# Altium project 36V E-Bike Reference Design.PrjPCB (part 1 of 4)
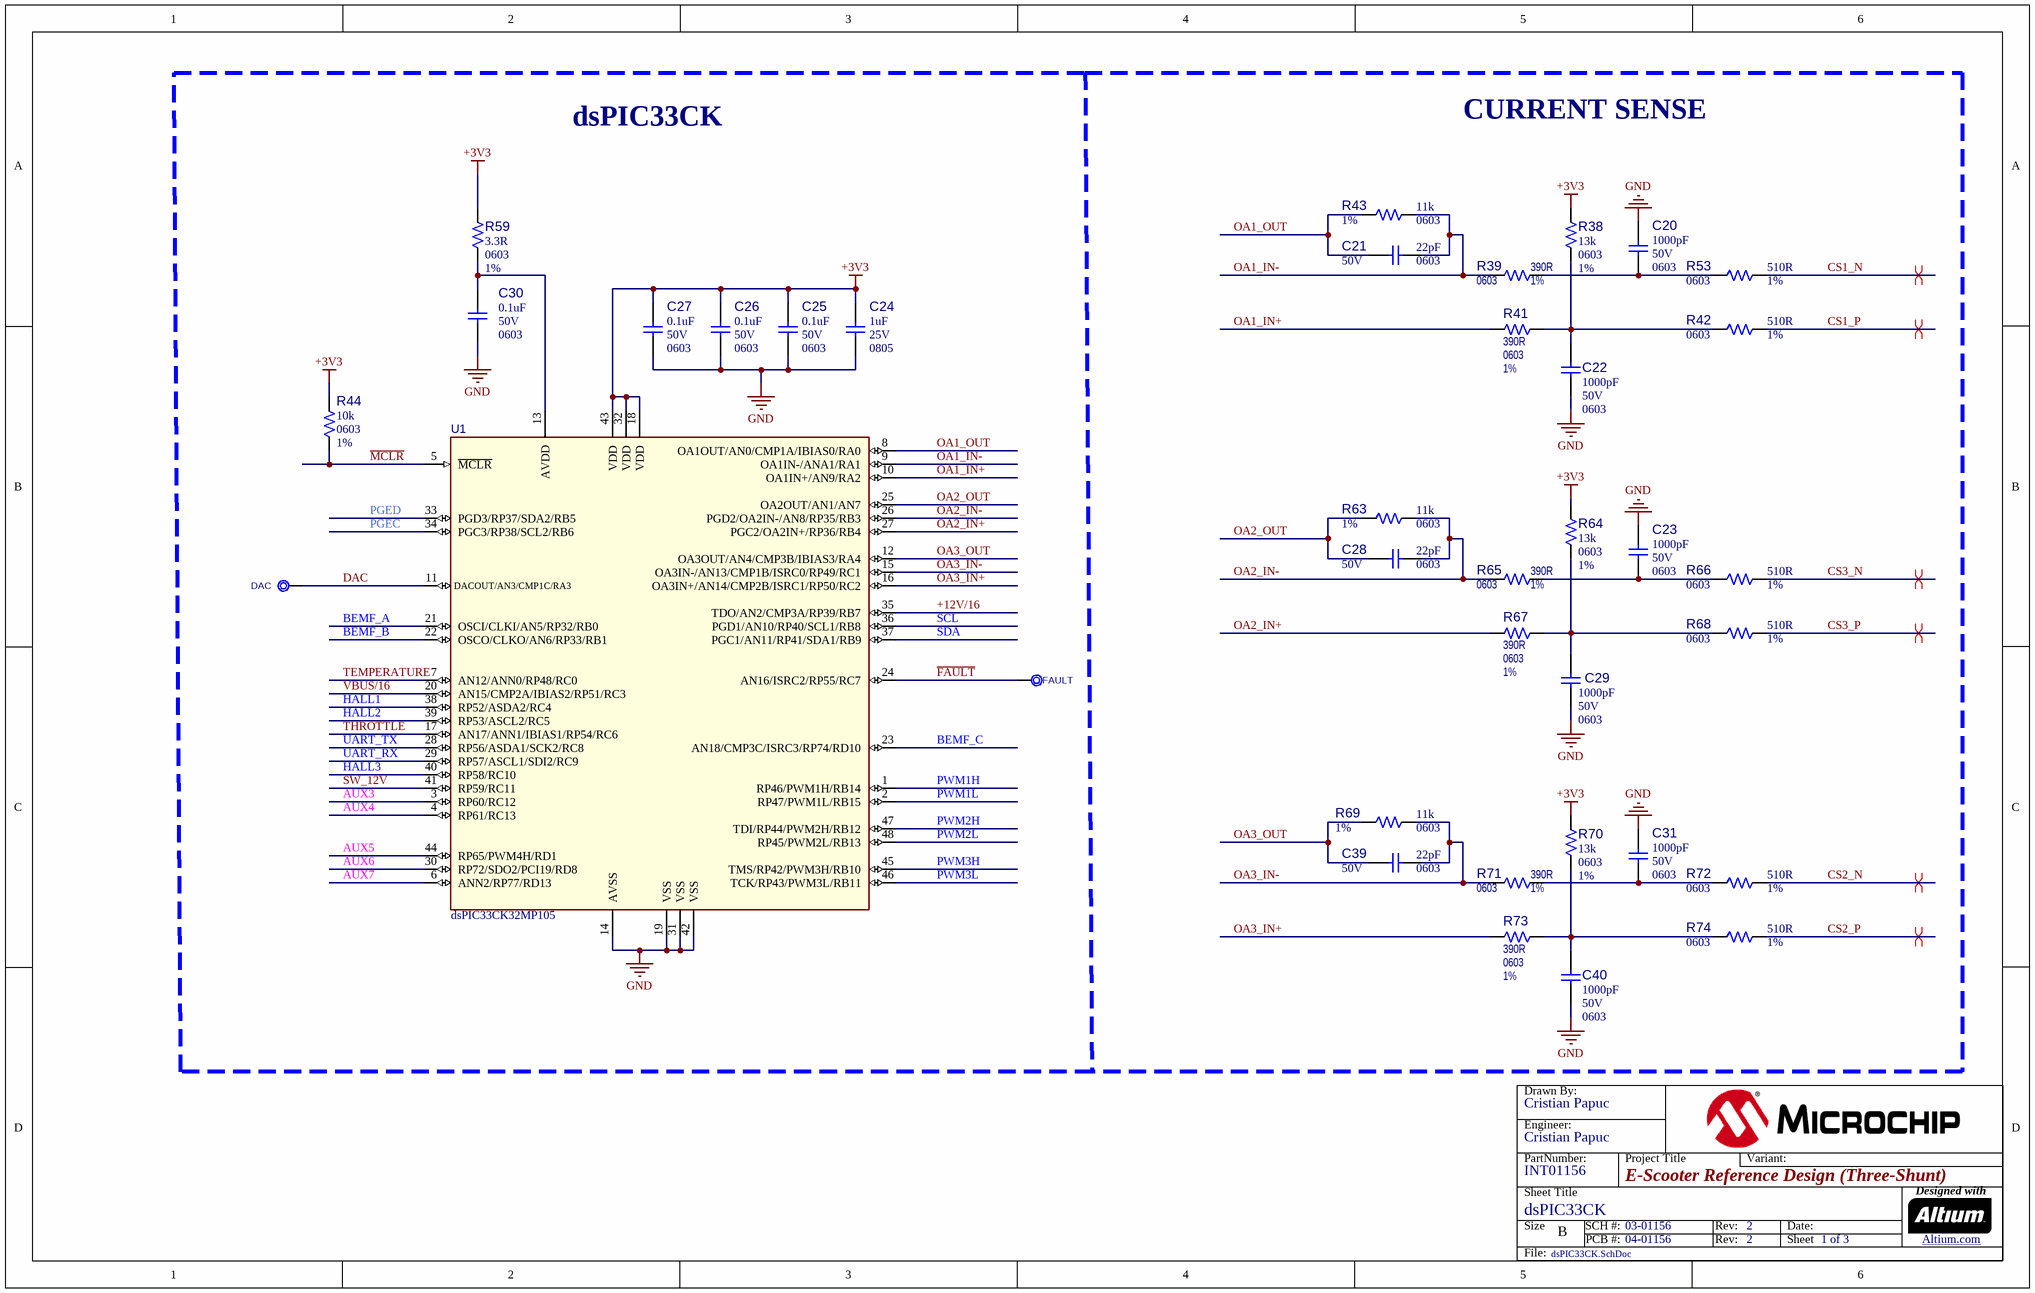
[diagram p0: dsPIC33CK.SchDoc]
ProjectDrawnBy: Cristian Papuc; ProjectEngineer: Cristian Papuc; ProjectPartNumber: INT01156; ProjectPCBAssyNumber: 01156; ProjectPCBNumber: 01156; ProjectRevisionART: 2; ProjectRevisionASSY: 2; ProjectRevisionFAB: 2; ProjectRevisionSCH: 2; ProjectTitle: E-Scooter Reference Design (Three-Shunt)
3 sheets, 182 parts. Net scope: global (net labels, ports and power ports of the same name join across sheets).
Board file: 01156.PcbDoc
Sheets:
  dsPIC33CK.SchDoc
  INVERTER.SchDoc
  POWER+HALL.SchDoc

## Sheet dsPIC33CK.SchDoc
size B; CompanyName: Microchip Technology Inc.; Organization: Microchip Technology; Address1: 2355 West Chandler Blvd.; Address2: Chandler, AZ  85224; Address4: USA; DocumentNumber: 1; SheetNumber: 1; SheetTotal: 3; SheetTitle: dsPIC33CK; Time: Time

### Parts
(Parts that share a designator on the sheet are numbered #1, #2 ... from top to bottom, then left to right.)
?#1  (no value)  (graphical)
C20  value 1000pF  Voltage: 50V  Package: 0603  [CAP_C_0603]  (hidden comment: Capacitor NP)
C21  value 22pF  Voltage: 50V  Package: 0603  [CAP_C_0603]  (hidden comment: Capacitor NP)
C22  value 1000pF  Voltage: 50V  Package: 0603  [CAP_C_0603]  (hidden comment: Capacitor NP)
C23  value 1000pF  Voltage: 50V  Package: 0603  [CAP_C_0603]  (hidden comment: Capacitor NP)
C24  value 1uF  Voltage: 25V  Package: 0805  [CAP_C_0805]  (hidden comment: Capacitor NP)
C25  value 0.1uF  Voltage: 50V  Package: 0603  [CAP_C_0603]  (hidden comment: Capacitor NP)
C26  value 0.1uF  Voltage: 50V  Package: 0603  [CAP_C_0603]  (hidden comment: Capacitor NP)
C27  value 0.1uF  Voltage: 50V  Package: 0603  [CAP_C_0603]  (hidden comment: Capacitor NP)
C28  value 22pF  Voltage: 50V  Package: 0603  [CAP_C_0603]  (hidden comment: Capacitor NP)
C29  value 1000pF  Voltage: 50V  Package: 0603  [CAP_C_0603]  (hidden comment: Capacitor NP)
C30  value 0.1uF  Voltage: 50V  Package: 0603  [CAP_C_0603]  (hidden comment: Capacitor NP)
C31  value 1000pF  Voltage: 50V  Package: 0603  [CAP_C_0603]  (hidden comment: Capacitor NP)
C39  value 22pF  Voltage: 50V  Package: 0603  [CAP_C_0603]  (hidden comment: Capacitor NP)
C40  value 1000pF  Voltage: 50V  Package: 0603  [CAP_C_0603]  (hidden comment: Capacitor NP)
DAC  DAC  [TP_1.2x0.7]  (no BOM)
R38  value 13k  Package: 0603  Tolerance: 1%  [RES_C_0603]  (hidden comment: Resistor)
R39  value 390R  Package: 0603  Tolerance: 1%  [RES_C_0603]  (hidden comment: Resistor)
R41  value 390R  Package: 0603  Tolerance: 1%  [RES_C_0603]  (hidden comment: Resistor)
R42  value 510R  Package: 0603  Tolerance: 1%  [RES_C_0603]  (hidden comment: Resistor)
R43  value 11k  Package: 0603  Tolerance: 1%  [RES_C_0603]  (hidden comment: Resistor)
R44  value 10k  Package: 0603  Tolerance: 1%  [RES_C_0603]  (hidden comment: Resistor)
R53  value 510R  Package: 0603  Tolerance: 1%  [RES_C_0603]  (hidden comment: Resistor)
R59  value 3.3R  Package: 0603  Tolerance: 1%  [RES_C_0603]  (hidden comment: Resistor)
R63  value 11k  Package: 0603  Tolerance: 1%  [RES_C_0603]  (hidden comment: Resistor)
R64  value 13k  Package: 0603  Tolerance: 1%  [RES_C_0603]  (hidden comment: Resistor)
R65  value 390R  Package: 0603  Tolerance: 1%  [RES_C_0603]  (hidden comment: Resistor)
R66  value 510R  Package: 0603  Tolerance: 1%  [RES_C_0603]  (hidden comment: Resistor)
R67  value 390R  Package: 0603  Tolerance: 1%  [RES_C_0603]  (hidden comment: Resistor)
R68  value 510R  Package: 0603  Tolerance: 1%  [RES_C_0603]  (hidden comment: Resistor)
R69  value 11k  Package: 0603  Tolerance: 1%  [RES_C_0603]  (hidden comment: Resistor)
R70  value 13k  Package: 0603  Tolerance: 1%  [RES_C_0603]  (hidden comment: Resistor)
R71  value 390R  Package: 0603  Tolerance: 1%  [RES_C_0603]  (hidden comment: Resistor)
R72  value 510R  Package: 0603  Tolerance: 1%  [RES_C_0603]  (hidden comment: Resistor)
R73  value 390R  Package: 0603  Tolerance: 1%  [RES_C_0603]  (hidden comment: Resistor)
R74  value 510R  Package: 0603  Tolerance: 1%  [RES_C_0603]  (hidden comment: Resistor)
TP1  FAULT  [TP_1.2x0.7]  (no BOM)
U1  dsPIC33CK32MP105  [TQFP-48_7x7]

### Blocks framed on the sheet
dsPIC33CK: C24-C27 C30 DAC R44 R59 TP1 U1

### Nets
+3V3: C24.2 C25.2 C26.2 C27.2 R38.1 R44.2 R59.2 R64.1 R70.1 U1.18(VDD) U1.32(VDD) U1.43(VDD)
GND: C20.2 C22.1 C23.2 C24.1 C25.1 C26.1 C27.1 C29.1 C30.1 C31.2 C40.1 U1.14(AVSS) U1.19(VSS) U1.31(VSS) U1.42(VSS)
+12V/16: U1.35(TDO/AN2/CMP3A/RP39/RB7)
~{FAULT}: TP1.1 U1.24(AN16/ISRC2/RP55/RC7)
~{MCLR}: R44.1 U1.5(~{MCLR})
AUX3: U1.3(RP60/RC12)
AUX4: U1.4(RP61/RC13)
AUX5: U1.44(RP65/PWM4H/RD1)
AUX6: U1.30(RP72/SDO2/PCI19/RD8)
AUX7: U1.6(ANN2/RP77/RD13)
BEMF_A: U1.21(OSCI/CLKI/AN5/RP32/RB0)
BEMF_B: U1.22(OSCO/CLKO/AN6/RP33/RB1)
BEMF_C: U1.23(AN18/CMP3C/ISRC3/RP74/RD10)
CS1_N: R53.2
CS1_P: R42.2
CS2_N: R72.2
CS2_P: R74.2
CS3_N: R66.2
CS3_P: R68.2
DAC: DAC.1 U1.11(DACOUT/AN3/CMP1C/RA3)
HALL1: U1.38(RP52/ASDA2/RC4)
HALL2: U1.39(RP53/ASCL2/RC5)
HALL3: U1.40(RP58/RC10)
OA1_IN+: R41.1 U1.10(OA1IN+/AN9/RA2)
OA1_IN-: C21.1 R39.1 R43.1 U1.9(OA1IN-/ANA1/RA1)
OA1_OUT: C21.2 R43.2 U1.8(OA1OUT/AN0/CMP1A/IBIAS0/RA0)
OA2_IN+: R67.1 U1.27(PGC2/OA2IN+/RP36/RB4)
OA2_IN-: C28.1 R63.1 R65.1 U1.26(PGD2/OA2IN-/AN8/RP35/RB3)
OA2_OUT: C28.2 R63.2 U1.25(OA2OUT/AN1/AN7)
OA3_IN+: R73.1 U1.16(OA3IN+/AN14/CMP2B/ISRC1/RP50/RC2)
OA3_IN-: C39.1 R69.1 R71.1 U1.15(OA3IN-/AN13/CMP1B/ISRC0/RP49/RC1)
OA3_OUT: C39.2 R69.2 U1.12(OA3OUT/AN4/CMP3B/IBIAS3/RA4)
PGEC: U1.34(PGC3/RP38/SCL2/RB6)
PGED: U1.33(PGD3/RP37/SDA2/RB5)
PWM1H: U1.1(RP46/PWM1H/RB14)
PWM1L: U1.2(RP47/PWM1L/RB15)
PWM2H: U1.47(TDI/RP44/PWM2H/RB12)
PWM2L: U1.48(RP45/PWM2L/RB13)
PWM3H: U1.45(TMS/RP42/PWM3H/RB10)
PWM3L: U1.46(TCK/RP43/PWM3L/RB11)
SCL: U1.36(PGD1/AN10/RP40/SCL1/RB8)
SDA: U1.37(PGC1/AN11/RP41/SDA1/RB9)
SW_12V: U1.41(RP59/RC11)
TEMPERATURE: U1.7(AN12/ANN0/RP48/RC0)
THROTTLE: U1.17(AN17/ANN1/IBIAS1/RP54/RC6)
UART_RX: U1.29(RP57/ASCL1/SDI2/RC9)
UART_TX: U1.28(RP56/ASDA1/SCK2/RC8)
VBUS/16: U1.20(AN15/CMP2A/IBIAS2/RP51/RC3)
NetC20_1: C20.1 R39.2 R53.1
NetC22_2: C22.2 R38.2 R41.2 R42.1
NetC23_1: C23.1 R65.2 R66.1
NetC29_2: C29.2 R64.2 R67.2 R68.1
NetC30_2: C30.2 R59.1 U1.13(AVDD)
NetC31_1: C31.1 R71.2 R72.1
NetC40_2: C40.2 R70.2 R73.2 R74.1

### Layout directives
differential pair: CS1_N, CS1_P, CS2_N, CS2_P, CS3_N, CS3_P

### Notes on the sheet
- CURRENT SENSE
- Drawn By:
- Engineer:
- PartNumber:
- Project Title
- Variant:
- Sheet Title
- Size
- B
- SCH #:
- PCB #:
- Rev:
- Date:
- Sheet
- Designed with
- Altium.com <http://go.altium.com/MicrochipLandingPage_Evaluation.html>
- File:

### Library data of the parts
?#1 = Title Block B
C20 C22 C23 C29 C31 C40 = CAP0031: Capacitor; Manufacturer 1: Wurth Electronics Inc; Manufacturer Part Number 1: 885012206083; Description_: CAP CER 1000pF 50V 10% X7R SMD 0603; Dev Tools Status: Production; Tolerance: 10%; Temperature Coeffcient: X7R; Type: Ceramic; Populated: Yes; MCHP-ID: CAP0031; Revision: 2; Symbol: Capacitor NP; Status: MCL Design; ComponentLink1URL: https://chn-vm-apps.microchip.com/mchprepo/parts/Datasheets/KEM_C1002_X7R_SMD.pdf; ComponentLink1Description: SVN Datasheet; ComponentLink2URL: C:\ALTIUM_WORK\00001_MCHP-CDB\Datasheets\KEM_C1002_X7R_SMD.pdf; ComponentLink2Description: Local Datasheet; ComponentLink3URL: C:\ALTIUM_WORK\00001_MCHP-CDB\Library\LibraryRefs\Capacitor NP.SchLib; ComponentLink3Description: Open Symbol; ComponentLink4URL: C:\ALTIUM_WORK\00001_MCHP-CDB\Library\Footprints\CAP_C_0603.PcbLib; ComponentLink4Description: Open Footprint; ComponentLink5Description: Open Footprint 2; ComponentLink6Description: Open Footprint 3; ComponentLink7Description: Open Footprint 4; Operating Temperature: -55C to +125C; Category: Capacitor; Manufacturer 2: Cal-Chip; Manufacturer Part Number 2: GMC10X7R102K50NTL_F; Manufacturer 3: AVX; Manufacturer Part Number 3: 06035C102KAT2A; Manufacturer 4: KEMET; Manufacturer Part Number 4: C0603C102K5RACTU; Manufacturer 5: Murata Electronics North America; Manufacturer Part Number 5: GCM188R71H102KA37J; Manufacturer 6: Panasonic; Manufacturer Part Number 6: ECU-V1H102KBV; Manufacturer 7: Panasonic; Manufacturer Part Number 7: ECJ-1VB1H102K; Manufacturer 8: NIC Components; Manufacturer Part Number 8: NMC0603X7R102K50TRPF; Supplier 1: Digi-Key; Supplier Part Number 1: 732-8001-1-ND; Supplier 2: Cal-Chip; Supplier Part Number 2: GMC10X7R102K50NTL_F; Supplier 3: Digi-Key; Supplier Part Number 3: 478-1215-1-ND; Supplier 4: Digi-Key; Supplier Part Number 4: 399-1082-1-ND; Supplier 5: Digi-Key; Supplier Part Number 5: 490-8019-1-ND; Supplier 6: Digi-Key; Supplier Part Number 6: PCC102BVTR-ND; Supplier 7: Digi-Key; Supplier Part Number 7: PCC1772TR-ND; Supplier 8: NIC Components; Supplier Part Number 8: NMC0603X7R102K50TRPF; Quantity Override: 1
C21 C28 C39 = CAP0074: Capacitor; Manufacturer 1: Cal-Chip; Manufacturer Part Number 1: GMC10CG220J50NTLF; Description_: CAP CER 22pF 50V 5% NP0 SMD 0603; Dev Tools Status: Production; Tolerance: 5%; Temperature Coeffcient: NP0; Type: Ceramic; Populated: Yes; MCHP-ID: CAP0074; Revision: 1; Symbol: Capacitor NP; Status: MCL Design; ComponentLink1URL: https://chn-vm-apps.microchip.com/mchprepo/parts/Datasheets/ECJ__General_.pdf; ComponentLink1Description: SVN Datasheet; ComponentLink2URL: C:\ALTIUM_WORK\00001_MCHP-CDB\Datasheets\ECJ__General_.pdf; ComponentLink2Description: Local Datasheet; ComponentLink3URL: C:\ALTIUM_WORK\00001_MCHP-CDB\Library\LibraryRefs\Capacitor NP.SchLib; ComponentLink3Description: Open Symbol; ComponentLink4URL: C:\ALTIUM_WORK\00001_MCHP-CDB\Library\Footprints\CAP_C_0603.PcbLib; ComponentLink4Description: Open Footprint; ComponentLink5Description: Open Footprint 2; ComponentLink6Description: Open Footprint 3; ComponentLink7Description: Open Footprint 4; Operating Temperature: -55C to +125C; Category: Capacitor; Manufacturer 2: Panasonic; Manufacturer Part Number 2: ECU-V1H220JCV; Manufacturer 3: Panasonic; Manufacturer Part Number 3: ECJ-1VC1H220J; Manufacturer 4: Yageo; Manufacturer Part Number 4: CC0603JRNP09BN220; Manufacturer 5: Yageo; Manufacturer Part Number 5: 0603CG220J9B200; Manufacturer 6: NIC Components; Manufacturer Part Number 6: NMC0603NPO220J50TRPF; Supplier 1: Cal-Chip; Supplier Part Number 1: GMC10CG220J50NTLF; Supplier 2: Digi-Key; Supplier Part Number 2: PCC220ACVTR-ND; Supplier 3: Digi-Key; Supplier Part Number 3: 311-1062-1-ND; Supplier 4: NIC Components; Supplier Part Number 4: NMC0603NPO220J50TRPF; Quantity Override: 1
C24 = CAP1211: Capacitor; Manufacturer 1: AVX; Manufacturer Part Number 1: 08053C105K4Z2A; Description_: CAP CER 1uF 25V 10% X7R SMD 0805; Dev Tools Status: Production; Tolerance: 10%; Temperature Coeffcient: X7R; Type: Ceramic; Owner: Tad Ahlvers; Populated: YES; MCHP-ID: CAP1211; Revision: 1; Symbol: Capacitor NP; Status: MCL Design; ComponentLink1URL: https://chn-vm-apps.microchip.com/mchprepo/parts/Datasheets/flexiterm.pdf; ComponentLink1Description: SVN Datasheet; ComponentLink2URL: C:\ALTIUM_WORK\00001_MCHP-CDB\Datasheets\flexiterm.pdf; ComponentLink2Description: Local Datasheet; ComponentLink3URL: C:\ALTIUM_WORK\00001_MCHP-CDB\Library\LibraryRefs\Capacitor NP.SchLib; ComponentLink3Description: Open Symbol; ComponentLink4URL: C:\ALTIUM_WORK\00001_MCHP-CDB\Library\Footprints\CAP_C_0805.PcbLib; ComponentLink4Description: Open Footprint; ComponentLink5Description: Open Footprint 2; ComponentLink6Description: Open Footprint 3; ComponentLink7Description: Open Footprint 4; Operating Temperature: -55C to +125C; Category: Capacitor; Manufacturer 2: KEMET; Manufacturer Part Number 2: C0805C105K3RACTU; Manufacturer 3: TDK Corporation; Manufacturer Part Number 3: C2012X7R1E105K125AB; Supplier 1: Digi-Key; Supplier Part Number 1: 478-6357-2-ND; Supplier 2: Digi-Key; Supplier Part Number 2: C0805C105K3RACTU-ND; Supplier 3: Digi-Key; Supplier Part Number 3: 445-1354-1-ND; Quantity Override: 1
C25-C27 C30 = CAP2016: Capacitor; Manufacturer 1: AVX Corporation; Manufacturer Part Number 1: 06035C104K4Z4A; Description_: CAP CER 0.1uF 50V 10% X7R AEC-Q200 SMD 0603; Dev Tools Status: Design; Tolerance: 10%; Temperature Coeffcient: X7R; Type: Ceramic; Owner: Sam Charles; Populated: YES; MCHP-ID: CAP2016; Revision: A; Symbol: Capacitor NP; Status: MCL Design; ComponentLink1URL: https://chn-vm-apps.microchip.com/mchprepo/parts/Datasheets/FlexitermMLCC.pdf; ComponentLink1Description: SVN Datasheet; ComponentLink2URL: C:\ALTIUM_WORK\00001_MCHP-CDB\Datasheets\FlexitermMLCC.pdf; ComponentLink2Description: Local Datasheet; ComponentLink3URL: C:\ALTIUM_WORK\00001_MCHP-CDB\Library\LibraryRefs\Capacitor NP.SchLib; ComponentLink3Description: Open Symbol; ComponentLink4URL: C:\ALTIUM_WORK\00001_MCHP-CDB\Library\Footprints\CAP_C_0603.PcbLib; ComponentLink4Description: Open Footprint; ComponentLink5Description: Open Footprint 2; ComponentLink6Description: Open Footprint 3; ComponentLink7Description: Open Footprint 4; Operating Temperature: -55°C ~ 125°C; Category: Capacitor; Supplier 1: Digi-Key; Supplier Part Number 1: 478-10679-1-ND; Quantity Override: 1
DAC TP1 = CON1128: Test Point; Value: TP PAD PCB 1.2x0.7; Description_: CON TP PAD PCB 1.2x0.7 TH; Dev Tools Status: Production; Owner: Bogdan P (M91398); Populated: Yes; MCHP-ID: CON1128; Revision: 0; Status: MCL Design; ComponentLink1Description: SVN Datasheet; Type: Test Point; Category: Connector; Quantity Override: 1; ComponentLink2Description: Local Datasheet; ComponentLink3Description: Open Symbol; ComponentLink3URL: C:\ALTIUM_WORK\00001_MCHP-CDB\Library\LibraryRefs\Test Point No BOM.SchLib; ComponentLink4Description: Open Footprint; ComponentLink4URL: C:\ALTIUM_WORK\00001_MCHP-CDB\Library\Footprints\TP_1.2x0.7.PcbLib; ComponentLink5Description: Open Footprint 2; ComponentLink6Description: Open Footprint 3; ComponentLink7Description: Open Footprint 4; Symbol: Test Point No BOM
R38 R64 R70 = RES1121: Manufacturer 1: Panasonic; Manufacturer Part Number 1: ERJ-3EKF1302V; Description_: RES TKF 13k 1% 1/10W SMD 0603; Dev Tools Status: Production; Voltage: 75V; Temperature Coeffcient: 100ppm/C; Power: 1/10W; Owner: Mihai T(M91442); Populated: Yes; MCHP-ID: RES1121; Revision: 0; Symbol: Resistor; Status: MCL Design; ComponentLink1URL: https://chn-vm-apps.microchip.com/mchprepo/parts/Datasheets/AOA0000CE2.pdf; ComponentLink1Description: SVN Datasheet; ComponentLink2URL: C:\ALTIUM_WORK\00001_MCHP-CDB\Datasheets\AOA0000CE2.pdf; ComponentLink2Description: Local Datasheet; ComponentLink3URL: C:\ALTIUM_WORK\00001_MCHP-CDB\Library\LibraryRefs\Resistor.SchLib; ComponentLink3Description: Open Symbol; ComponentLink4URL: C:\ALTIUM_WORK\00001_MCHP-CDB\Library\Footprints\RES_C_0603.PcbLib; ComponentLink4Description: Open Footprint; ComponentLink5Description: Open Footprint 2; ComponentLink6Description: Open Footprint 3; ComponentLink7Description: Open Footprint 4; Operating Temperature: -55C to +155C; Category: Resistor; Type: RES SMD; Composition: TKF; Supplier 1: Digi-Key; Supplier Part Number 1: P13.0KHCT-ND; Supplier 2: Farnell; Supplier Part Number 2: 2059416; Quantity Override: 1
R39 R41 R65 R67 R71 R73 = RES1171: Manufacturer 1: Panasonic; Manufacturer Part Number 1: ERJ-3EKF3900V; Description_: RES TKF 390R 1% 1/10W SMD 0603; Dev Tools Status: Production; Voltage: 75V; Temperature Coeffcient: 100ppm/C; Power: 1/10W; Owner: Bogdan P (M91398); Populated: Yes; MCHP-ID: RES1171; Revision: 0; Symbol: Resistor; Status: MCL Design; ComponentLink1URL: https://chn-vm-apps.microchip.com/mchprepo/parts/Datasheets/AOA0000CE2.pdf; ComponentLink1Description: SVN Datasheet; ComponentLink2URL: C:\ALTIUM_WORK\00001_MCHP-CDB\Datasheets\AOA0000CE2.pdf; ComponentLink2Description: Local Datasheet; ComponentLink3URL: C:\ALTIUM_WORK\00001_MCHP-CDB\Library\LibraryRefs\Resistor.SchLib; ComponentLink3Description: Open Symbol; ComponentLink4URL: C:\ALTIUM_WORK\00001_MCHP-CDB\Library\Footprints\RES_C_0603.PcbLib; ComponentLink4Description: Open Footprint; ComponentLink5Description: Open Footprint 2; ComponentLink6Description: Open Footprint 3; ComponentLink7Description: Open Footprint 4; Operating Temperature: -55C to +155C; Category: Resistor; Type: RES SMD; Composition: TKF; Supplier 1: Digi-Key; Supplier Part Number 1: P390HCT-ND; Quantity Override: 1
R42 R53 R66 R68 R72 R74 = RSMT0294: Manufacturer 1: Vishay Dale; Manufacturer Part Number 1: CRCW0603510RFKEA; Description_: RES TKF 510R 1% 1/10W SMD 0603; Dev Tools Status: Production; Voltage: 50V; Temperature Coeffcient: 100ppm/C; Power: 1/10W; Populated: Yes; MCHP-ID: RSMT0294; Revision: 1; Symbol: Resistor; Status: MCL Design; ComponentLink1URL: https://chn-vm-apps.microchip.com/mchprepo/parts/Datasheets/PYu-RC0603_51_RoHS_L_4.pdf; ComponentLink1Description: SVN Datasheet; ComponentLink2URL: C:\ALTIUM_WORK\00001_MCHP-CDB\Datasheets\PYu-RC0603_51_RoHS_L_4.pdf; ComponentLink2Description: Local Datasheet; ComponentLink3URL: C:\ALTIUM_WORK\00001_MCHP-CDB\Library\LibraryRefs\Resistor.SchLib; ComponentLink3Description: Open Symbol; ComponentLink4URL: C:\ALTIUM_WORK\00001_MCHP-CDB\Library\Footprints\RES_C_0603.PcbLib; ComponentLink4Description: Open Footprint; ComponentLink5Description: Open Footprint 2; ComponentLink6Description: Open Footprint 3; ComponentLink7Description: Open Footprint 4; Operating Temperature: -55C to +155C; Category: Resistor; Type: RES SMD; Composition: TKF; Manufacturer 2: ROHM; Manufacturer Part Number 2: MCR03EZPFX5100; Manufacturer 3: Yageo; Manufacturer Part Number 3: 9C06031A5100FKHFT; Manufacturer 4: Yageo; Manufacturer Part Number 4: 9C06031A5100FKPFT; Supplier 1: Digi-Key; Supplier Part Number 1: 541-510HCT-ND; Supplier 2: Digi-Key; Supplier Part Number 2: RHM510HCT-ND; Supplier 3: Digi-Key; Supplier Part Number 3: 311-510HTR-ND; Supplier 4: Yageo; Supplier Part Number 4: 9C06031A5100FKPFT; Quantity Override: 1
R43 R63 R69 = RSMT0550: Manufacturer 1: Panasonic; Manufacturer Part Number 1: ERJ-3EKF1102V; Description_: RES TKF 11k 1% 1/10W SMD 0603; Dev Tools Status: Production; Voltage: 75V; Temperature Coeffcient: 100ppm/C; Power: 1/10W; Populated: Yes; MCHP-ID: RSMT0550; Revision: 1; Symbol: Resistor; Status: MCL Design; ComponentLink1URL: https://chn-vm-apps.microchip.com/mchprepo/parts/Datasheets/AOA0000CE2.pdf; ComponentLink1Description: SVN Datasheet; ComponentLink2URL: C:\ALTIUM_WORK\00001_MCHP-CDB\Datasheets\AOA0000CE2.pdf; ComponentLink2Description: Local Datasheet; ComponentLink3URL: C:\ALTIUM_WORK\00001_MCHP-CDB\Library\LibraryRefs\Resistor.SchLib; ComponentLink3Description: Open Symbol; ComponentLink4URL: C:\ALTIUM_WORK\00001_MCHP-CDB\Library\Footprints\RES_C_0603.PcbLib; ComponentLink4Description: Open Footprint; ComponentLink5Description: Open Footprint 2; ComponentLink6Description: Open Footprint 3; ComponentLink7Description: Open Footprint 4; Operating Temperature: -55C to +155C; Category: Resistor; Type: RES SMD; Composition: TKF; Supplier 1: Digi-Key; Supplier Part Number 1: P11.0KHCT-ND; Quantity Override: 1
R44 = RSMT0139: Manufacturer 1: Panasonic; Manufacturer Part Number 1: ERJ-3EKF1002V; Description_: RES TKF 10k 1% 1/10W SMD 0603; Dev Tools Status: Production; Temperature Coeffcient: 100ppm/C; Power: 1/10W; Populated: Yes; MCHP-ID: RSMT0139; Revision: 2; Symbol: Resistor; Status: MCL Design; ComponentLink1URL: https://chn-vm-apps.microchip.com/mchprepo/parts/Datasheets/nrc.pdf; ComponentLink1Description: SVN Datasheet; ComponentLink2URL: C:\ALTIUM_WORK\00001_MCHP-CDB\Datasheets\nrc.pdf; ComponentLink2Description: Local Datasheet; ComponentLink3URL: C:\ALTIUM_WORK\00001_MCHP-CDB\Library\LibraryRefs\Resistor.SchLib; ComponentLink3Description: Open Symbol; ComponentLink4URL: C:\ALTIUM_WORK\00001_MCHP-CDB\Library\Footprints\RES_C_0603.PcbLib; ComponentLink4Description: Open Footprint; ComponentLink5Description: Open Footprint 2; ComponentLink6Description: Open Footprint 3; ComponentLink7Description: Open Footprint 4; Operating Temperature: -55C to +155C; Category: Resistor; Type: RES SMD; Composition: TKF; Manufacturer 2: Stackpole Electronics Inc; Manufacturer Part Number 2: RMCF0603FT10K0; Manufacturer 3: Stackpole Electronics Inc; Manufacturer Part Number 3: RMCF 1/16 10K 1% R; Manufacturer 4: Yageo; Manufacturer Part Number 4: RC0603FR-0710KL; Manufacturer 5: Xicon; Manufacturer Part Number 5: 302-10K-RC; Manufacturer 6: NIC Components; Manufacturer Part Number 6: NRC06F1002TRF; Supplier 1: Digi-Key; Supplier Part Number 1: P10.0KHCT-ND; Supplier 2: Digi-Key; Supplier Part Number 2: RMCF1/1610KFRTR-ND; Supplier 3: Digi-Key; Supplier Part Number 3: RMCF0603FT10K0TR-ND; Supplier 4: Digi-Key; Supplier Part Number 4: 311-10.0KHRCT-ND; Supplier 5: Mouser; Supplier Part Number 5: 302-10k-RC; Supplier 6: NIC Components; Supplier Part Number 6: NRC06F1002TRF; Quantity Override: 1
R59 = RES1051: Manufacturer 1: Panasonic; Manufacturer Part Number 1: ERJ-3RQF3R3V; Description_: RES TKF 3.3R 1% 1/10W SMD 0603; Dev Tools Status: Production; Temperature Coeffcient: 200ppm/C; Power: 1/10W; Owner: Tad Ahlvers; Populated: YES; MCHP-ID: RES1051; Revision: 1; Symbol: Resistor; Status: MCL Design; ComponentLink1URL: https://chn-vm-apps.microchip.com/mchprepo/parts/Datasheets/AOA0000CE3.pdf; ComponentLink1Description: SVN Datasheet; ComponentLink2URL: C:\ALTIUM_WORK\00001_MCHP-CDB\Datasheets\AOA0000CE3.pdf; ComponentLink2Description: Local Datasheet; ComponentLink3URL: C:\ALTIUM_WORK\00001_MCHP-CDB\Library\LibraryRefs\Resistor.SchLib; ComponentLink3Description: Open Symbol; ComponentLink4URL: C:\ALTIUM_WORK\00001_MCHP-CDB\Library\Footprints\RES_C_0603.PcbLib; ComponentLink4Description: Open Footprint; ComponentLink5Description: Open Footprint 2; ComponentLink6Description: Open Footprint 3; ComponentLink7Description: Open Footprint 4; Operating Temperature: -55C to +125C; Category: Resistor; Type: RES SMD; Composition: TKF; Supplier 1: Digi-Key; Supplier Part Number 1: P3.3AJCT-ND; Quantity Override: 1
U1 = MIC9024: Manufacturer 1: Microchip Technology Inc; Manufacturer Part Number 1: DSPIC33CK32MP105-I/PT; Description_: MCHP MCU 16-BIT 100MHz 256kB 64kB DSPIC33CK32MP105-I/PT TQFP-48; MAPS Description: dsPIC33C 100MHz, 32K  Flash, 8K RAM, OpAmps, 12bit ADCs, PWM; Dev Tools Status: Design; Owner: Octavian Stroe; MPC: WACU17Y8XBXF; LeadContent: Pb-FREE; TempRange: -40C to +85C; Stage: REL; PackageWidth: 7x7x1mm; PackingMedia: TRAY; ForceMinOrderQtyMult: True; MinOrderQty: 250; LeadCount: 48; Program Memory KBytes: 32; Program Memory KWords: 16; Ram: 8192; EEPROM: 0; MaxSpeed: 100; OscillatorMHz: 8MHz, 32kHz; Comparators: 3; ADC Channels: 19; ADCBit: 12; DAChannels: 1; mtrlcntrlpwmchannels: 8; QEI Channels: 2; DigitalTimerQty_16bit: 11; DigitalTimerQty_32bit: 5; Populated: YES; MCHP-ID: MIC9024; Value: dsPIC33CK32MP105; Symbol: dsPIC33CK32MP105 TQFP-48; Type: 16-Bit; Status: MCL Design; Revision: 1; Category: MCHP-Microcontroller; ComponentLink1URL: http://www.microchip.com/wwwproducts/dsPIC33CK32MP105; ComponentLink1Description: SVN Datasheet; ComponentLink2URL: C:\ALTIUM_WORK\00001_MCHP-CDB\Datasheets\70005363b.pdf; ComponentLink2Description: Local Datasheet; ComponentLink3URL: C:\ALTIUM_WORK\00001_MCHP-CDB\Library\LibraryRefs\dsPIC33CK32MP105 TQFP-48.SchLib; ComponentLink3Description: Open Symbol; ComponentLink4URL: C:\ALTIUM_WORK\00001_MCHP-CDB\Library\Footprints\TQFP-48_7x7.PcbLib; ComponentLink4Description: Open Footprint; ComponentLink5Description: Open Footprint 2; ComponentLink6Description: Open Footprint 3; ComponentLink7Description: Open Footprint 4; Supplier 1: Digikey; Supplier Part Number 1: DSPIC33CK32MP105-I/PT-ND; IntroductionDate: 2019-02-20; PackageType: TQFP; Family: 16-bit MCU/DSC; IOPins: 16; USART: 3; SPI: 3; I2C: 3; CAN: 0; USBChannels: 0; Input Capture: 0; PWM Channels: 0; SMPS PWM Channels: 8; SegmentLCD: 0; DigitalTimerQty_8bit: 0; Quantity Override: 1